# Altium schematic sheet DI 220V DC.SchDoc
size A4
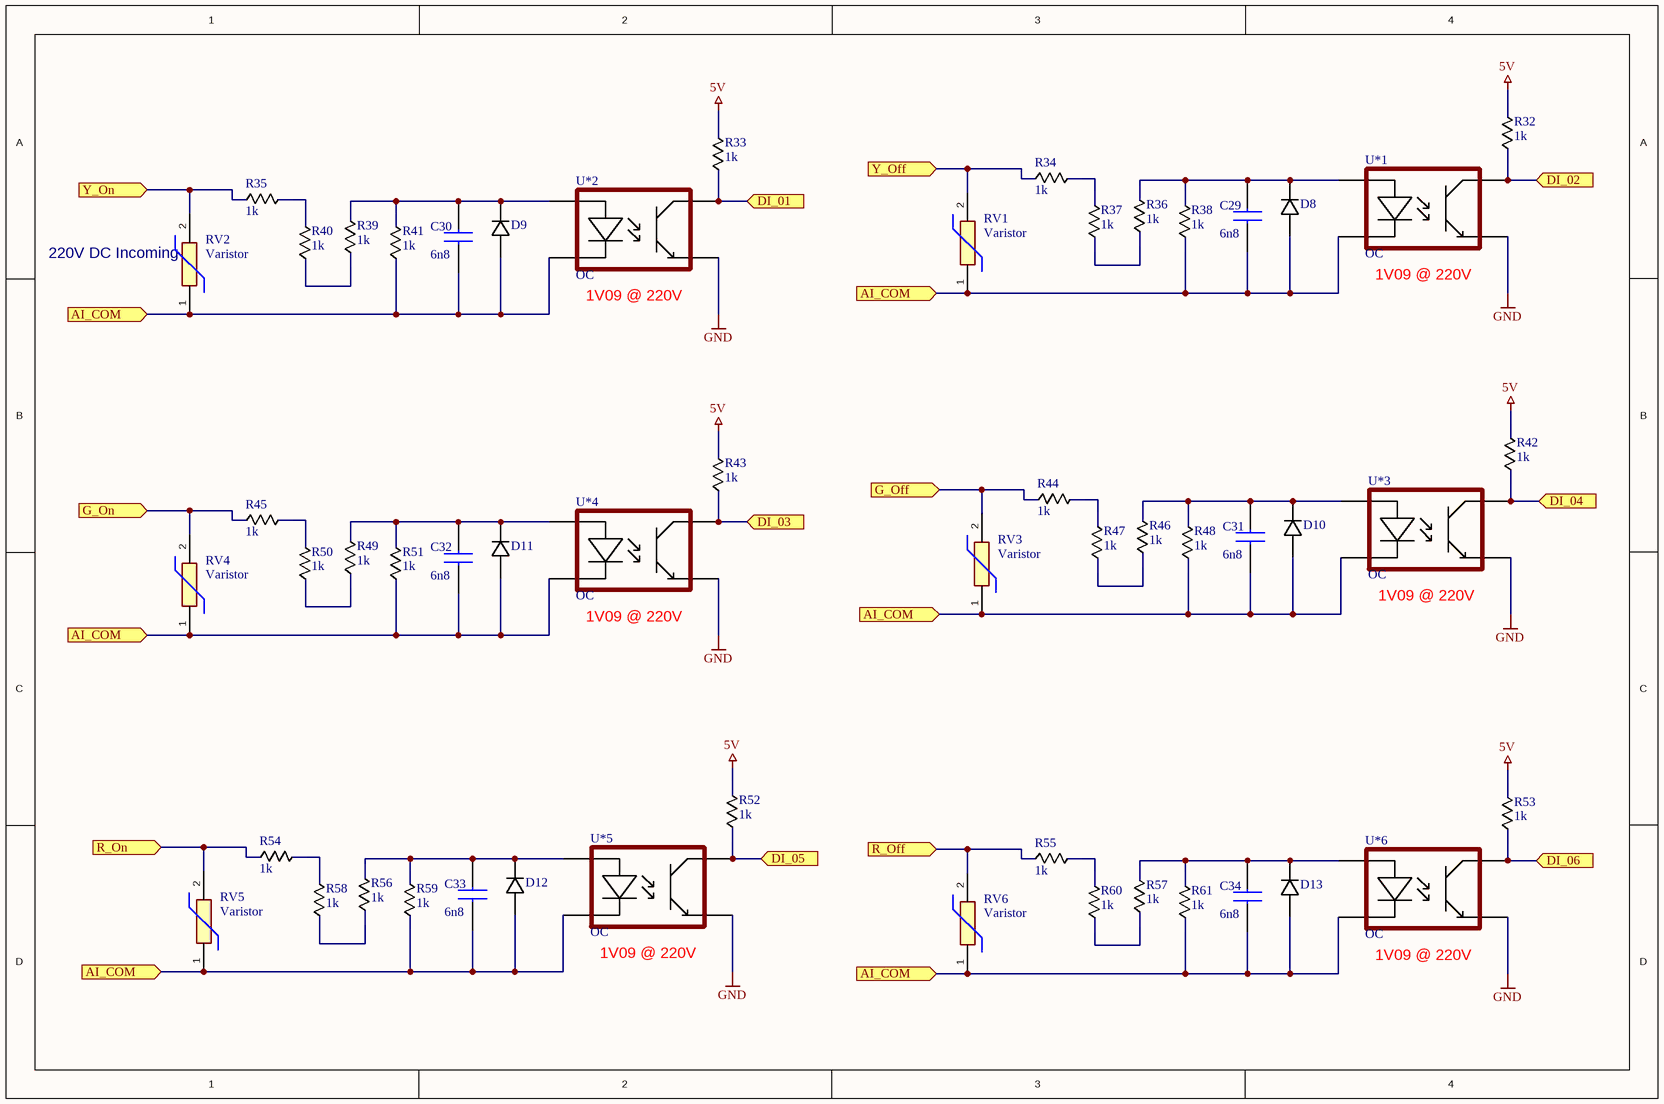
[diagram p0: DI 220V DC.SchDoc]

## Parts
C29  6n8  [0603 CAP]
C30  6n8  [0603 CAP]
C31  6n8  [0603 CAP]
C32  6n8  [0603 CAP]
C33  6n8  [0603 CAP]
C34  6n8  [0603 CAP]
D8  Diode_1  [SOD-323 (SC-76) - Reflow]  (value not drawn)
D9  Diode_1  [SOD-323 (SC-76) - Reflow]  (value not drawn)
D10  Diode_1  [SOD-323 (SC-76) - Reflow]  (value not drawn)
D11  Diode_1  [SOD-323 (SC-76) - Reflow]  (value not drawn)
D12  Diode_1  [SOD-323 (SC-76) - Reflow]  (value not drawn)
D13  Diode_1  [SOD-323 (SC-76) - Reflow]  (value not drawn)
R32  1k  [0603 CAP]
R33  1k  [0603 CAP]
R34  1k  [1206 Res]
R35  1k  [1206 Res]
R36  1k  [1206 Res]
R37  1k  [1206 Res]
R38  1k  [1206 Res]
R39  1k  [1206 Res]
R40  1k  [1206 Res]
R41  1k  [1206 Res]
R42  1k  [0603 CAP]
R43  1k  [0603 CAP]
R44  1k  [1206 Res]
R45  1k  [1206 Res]
R46  1k  [1206 Res]
R47  1k  [1206 Res]
R48  1k  [1206 Res]
R49  1k  [1206 Res]
R50  1k  [1206 Res]
R51  1k  [1206 Res]
R52  1k  [0603 CAP]
R53  1k  [0603 CAP]
R54  1k  [1206 Res]
R55  1k  [1206 Res]
R56  1k  [1206 Res]
R57  1k  [1206 Res]
R58  1k  [1206 Res]
R59  1k  [1206 Res]
R60  1k  [1206 Res]
R61  1k  [1206 Res]
RV1  Varistor  [S10K275]
RV2  Varistor  [S10K275]
RV3  Varistor  [S10K275]
RV4  Varistor  [S10K275]
RV5  Varistor  [S10K275]
RV6  Varistor  [S10K275]
U*1  OC  [LTV-357T]
U*2  OC  [LTV-357T]
U*3  OC  [LTV-357T]
U*4  OC  [LTV-357T]
U*5  OC  [LTV-357T]
U*6  OC  [LTV-357T]

## Ports
AI_COM, DI_01, DI_02, DI_03, DI_04, DI_05, DI_06, G_Off, G_On, R_Off, R_On, Y_Off, Y_On

## Nets
5V: R32.2 R33.2 R42.2 R43.2 R52.2 R53.2
GND: U*1.Emmiter(E) U*2.Emmiter(E) U*3.Emmiter(E) U*4.Emmiter(E) U*5.Emmiter(E) U*6.Emmiter(E)
AI_COM: C29.1 C30.1 C31.1 C32.1 C33.1 C34.1 D8.2(A) D9.2(A) D10.2(A) D11.2(A) D12.2(A) D13.2(A) R38.1 R41.1 R48.1 R51.1 R59.1 R61.1 RV1.1 RV2.1 RV3.1 RV4.1 RV5.1 RV6.1 U*1.Cathode(C) U*2.Cathode(C) U*3.Cathode(C) U*4.Cathode(C) U*5.Cathode(C) U*6.Cathode(C) ; port AI_COM
DI_01: R33.1 U*2.Collector(C) ; port DI_01
DI_02: R32.1 U*1.Collector(C) ; port DI_02
DI_03: R43.1 U*4.Collector(C) ; port DI_03
DI_04: R42.1 U*3.Collector(C) ; port DI_04
DI_05: R52.1 U*5.Collector(C) ; port DI_05
DI_06: R53.1 U*6.Collector(C) ; port DI_06
G_Off: R44.1 RV3.2 ; port G_Off
G_On: R45.1 RV4.2 ; port G_On
R_Off: R55.1 RV6.2 ; port R_Off
R_On: R54.1 RV5.2 ; port R_On
Y_Off: R34.1 RV1.2 ; port Y_Off
Y_On: R35.1 RV2.2 ; port Y_On
NetC29_2: C29.2 D8.1(C) R36.2 R38.2 U*1.Anode(A)
NetC30_2: C30.2 D9.1(C) R39.2 R41.2 U*2.Anode(A)
NetC31_2: C31.2 D10.1(C) R46.2 R48.2 U*3.Anode(A)
NetC32_2: C32.2 D11.1(C) R49.2 R51.2 U*4.Anode(A)
NetC33_2: C33.2 D12.1(C) R56.2 R59.2 U*5.Anode(A)
NetC34_2: C34.2 D13.1(C) R57.2 R61.2 U*6.Anode(A)
NetR34_2: R34.2 R37.2
NetR35_2: R35.2 R40.2
NetR36_1: R36.1 R37.1
NetR39_1: R39.1 R40.1
NetR44_2: R44.2 R47.2
NetR45_2: R45.2 R50.2
NetR46_1: R46.1 R47.1
NetR49_1: R49.1 R50.1
NetR54_2: R54.2 R58.2
NetR55_2: R55.2 R60.2
NetR56_1: R56.1 R58.1
NetR57_1: R57.1 R60.1

## Notes on the sheet
- (near RV2) 220V DC Incoming
- (near U*2) 1V09 @ 220V
- (near U*1) 1V09 @ 220V
- (near U*4) 1V09 @ 220V
- (near U*3) 1V09 @ 220V
- (near U*5) 1V09 @ 220V
- (near U*6) 1V09 @ 220V

## Library data of the parts
C29-C34 = 0603 CAP: GRM188R71H682MA01D; Manufacturer_Name: Murata Electronics; Manufacturer_Part_Number: GRM188R72A103KA01D; Datasheet Link: https://search.murata.co.jp/Ceramy/image/img/A01X/G101/ENG/GRM188R72A103KA01-01A.pdf; Height: 0.9mm; Mouser Part Number: 81-GRM188R72A103KA1D; Mouser Price/Stock: https://www.mouser.co.uk/ProductDetail/Murata-Electronics/GRM188R72A103KA01D?qs=krk%2F6UQjCzAtl9phuocbug%3D%3D; Arrow Part Number: GRM188R72A103KA01D; Arrow Price/Stock: https://www.arrow.com/en/products/grm188r72a103ka01d/murata-manufacturing?region=europe
D8-D13 = Diode_1: 1N4148WS
R32 R33 R42 R43 R52 R53 = 0603 RES
R34-R41 R44-R51 R54-R61 = 1206 RES
RV1-RV6 = B72210S0271K101: B72210-S 271-K101; Manufacturer_Name: TDK; Datasheet Link: https://product.tdk.com/system/files/dam/doc/product/protection/voltage/lead-disk-varistor/data_sheet/70/db/var/siov_leaded_standard.pdf; Manufacturer_Part_Number: B72210S0271K101; Mouser Part Number: 871-B72210S271K101; Mouser Price/Stock: https://www.mouser.co.uk/ProductDetail/EPCOS-TDK/B72210S0271K101?qs=dEfas%2FXlABJcVym03yTASg%3D%3D; Arrow Part Number: B72210S0271K101; Arrow Price/Stock: https://www.arrow.com/en/products/b72210s0271k101/tdk?utm_currency=USD&region=europe
U*1-U*6 = LTV-357T: pin to pad: Anode>1 Cathode>2 Collector>4 Emmiter>3